# EAGLE design USB_Protect_A (EAGLE 6.5.0)
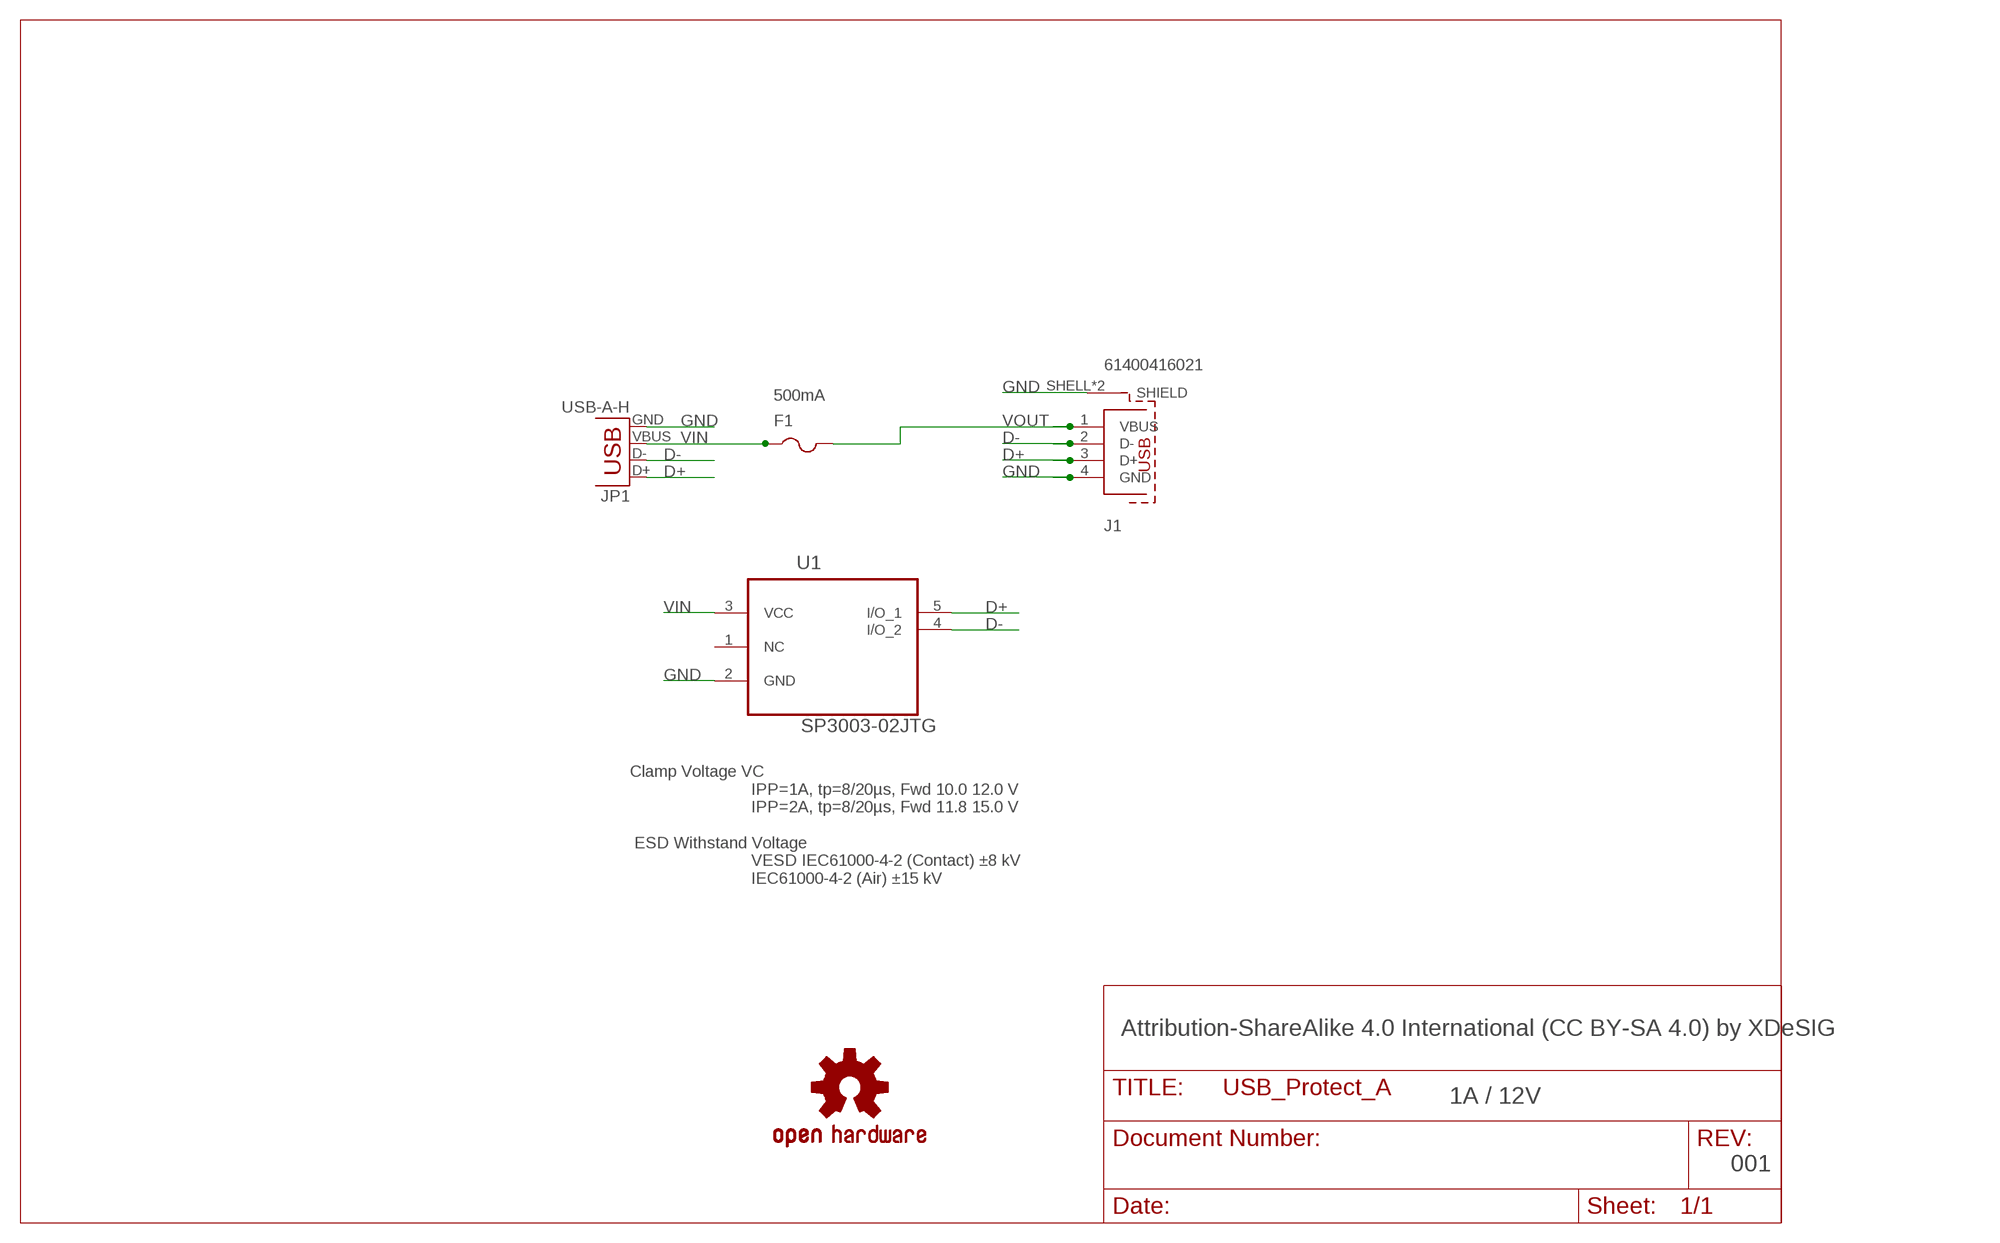
[diagram p0: schematic, sheet 1]

## Parts
F1  500mA  PTCFUSE-1206  [R1206]
J1  61400416021  [61400416021]
JP1  USB-A-H  [USB-A-H]
LOGO1  OSHW-LOGOS  [ESCORNA_LBRESCORNA_CPU_2_10_SPARKFUN-AESTHETICS_OSHW-LOGO-S]
U1  SP3003-02JTG  [SOT65P220X110-5N]

## Nets
D+: J1.3(D+) JP1.D+ U1.5(I/O_1)
D-: J1.2(D-) JP1.D- U1.4(I/O_2)
GND: J1.4(GND) J1.SHELL1(SHIELD) J1.SHELL(SHIELD) JP1.GND U1.2(GND)
VIN: F1.1 JP1.VBUS U1.3(VCC)
VOUT: F1.2 J1.1(VBUS)
Unconnected: U1.1(NC)

## Notes on the sheet
- Clamp Voltage VC 
                             IPP=1A, tp=8/20µs, Fwd 10.0 12.0 V 
                             IPP=2A, tp=8/20µs, Fwd 11.8 15.0 V
  
   ESD Withstand Voltage 
                             VESD IEC61000-4-2 (Contact) ±8 kV 
                             IEC61000-4-2 (Air) ±15 kV
- Attribution-ShareAlike 4.0 International (CC BY-SA 4.0) by XDeSIG
- 1A / 12V
- 001

## Library data of the parts
F1 = adafruit:PTCFUSE: PTC fuses, resettable thermistors
J1 = USB_female:61400416021: WR-COM Horizontal USB Type A=>Code :Con_I-O_COM_USB_2.0_A_61400416021 <http://katalog.we-online.de/media/images/eican/Con_I-O_COM_USB_2.0_A_61400416021_pf2.jpg> Details see: http://katalog.we-online.de/en/em/614_004_160_21 Created 2014-07-09, Karrer Zheng 2014 (C) Würth Elektronik; AVAILABILITY: Unavailable; DESCRIPTION: WR-COM Series, Right Angle Type A USB Connector Socket, 30 V ac, 1.5A; MF: Wurth Electronics; MP: 61400416021; PACKAGE: None; PRICE: None
JP1 = SparkFun-Connectors:USB: USB Connectors USB-B-PTH is fully proven SKU : PRT-00139/CONN-08278 USB-miniB is fully proven SKU : PRT-00587 USB-A-PCB is untested. USB-A-H is throughly reviewed, but untested. Spark Fun Electronics SKU : PRT-00437 USB-B-SMT is throughly reviewed, but untested. Needs silkscreen touching up. USB-A-S has not been used/tested USB-MB-H has not been used/tested USB-MICROB has been used. CONN-09505; PROD_ID: CONN-08367
LOGO1 = Echidna_shield_LBR:OSHW-LOGO: Open Source Hardware Logo This logo indicates the piece of hardware it is found on incorporates a OSHW license and/or adheres to the definition of open source hardware found here: http://freedomdefined.org/OSHW
U1 = SP3003-02JTG:SP3003-02JTG: 0.65pF Rail Clamp Array; AVAILABILITY: Good; DESCRIPTION: TVS DIODE 6VWM 15VC SC70-5; MF: Littelfuse; MP: SP3003-02JTG; PACKAGE: SC-70 Littelfuse; PRICE: 0.54 USD

## Net classes
0 default: width 0.254 mm, drill 0.61 mm, clearance 0.254 mm

## Board
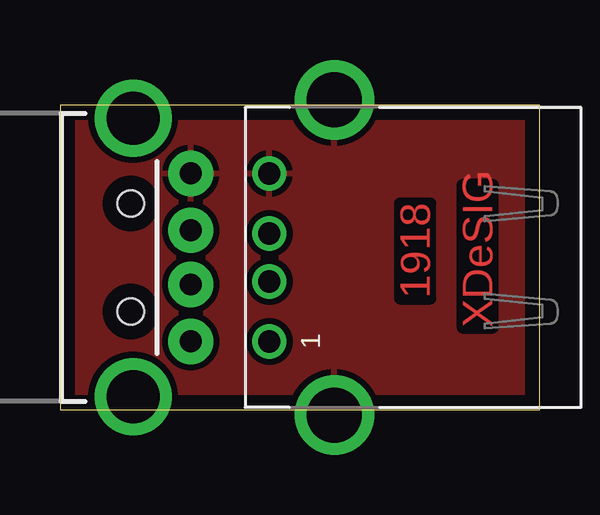
[diagram p1: board, top side]
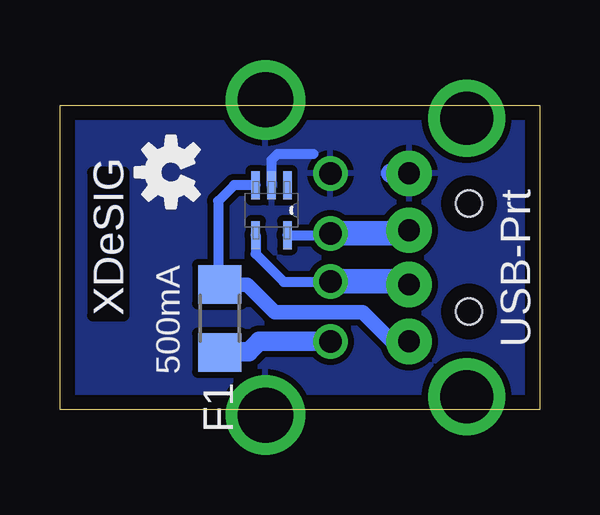
[diagram p2: board, bottom side, seen from below]

Size 19.99 x 12.69 mm. Coordinates in mm from the lower left corner, seen from the top.
Outline: 0,0 19.99,0 19.99,12.69 0,12.69 0,0
Copper layers (1*16): Top 0.035mm / dielectric 1.5mm / Bottom 0.035mm
Design rules "default": minimum track width 10mil, minimum drill 22mil, track to track 10mil, track to pad 10mil, pad to pad 8mil, via to via 12mil, smd to smd 8mil, copper to edge 24mil, drill to drill 12mil, minimum pad ring 10mil, minimum via ring 10mil, stop-mask expansion 2mil, vias tented up to drill 30mil, thermal gap 10mil

### Footprints (pad centres in the part's own frame; a part is rotated, then mirrored left to right if it is on the bottom)
R1206 = smd 1.6 x 1.803: 1 -1.422,0; 2 1.422,0
61400416021 = drill 0.92: 1 -3.5,2.71; 2 -1,2.71; 3 1,2.71; 4 3.5,2.71 | drill 2.3: SHELL -6.57,0; SHELL1 6.57,0
USB-A-H = drill 0.914 pad 1.88: D+ 2.4,1.127; D- 2.4,-1.127; GND 2.4,3.5; VBUS 2.4,-3.5 | drill 2.2: GND2 0,-5.8; GND3 0,5.8 | hole 1.1: -0.1,2.25; -0.1,-2.25
SOT65P220X110-5N = smd 1.168 x 0.356: 1 -1.041,0.66; 2 -1.041,0; 3 -1.041,-0.66; 4 1.041,-0.66; 5 1.041,0.66

### Placement (x,y rotation side)
F1  13.34,3.81 270 bottom
J1  11.43,6.35 90 top
JP1  3.05,6.35 0 top
LOGO1  15.37,9.91 90 bottom
U1  11.18,8.32 270 bottom

### Tracks (layer width: path | path; a pad name or v marks a point on that pad's centre or on a via)
D+
  Bottom 0.406: U1.5 8.79,7.28 J1.3
  Bottom 0.813: 6.34,7.35 JP1.D+
  Bottom 1.016: J1.3 6.21,7.35 JP1.D+
D-
  Bottom 0.406: U1.4 11.84,6.5 10.67,5.33 8.74,5.33 J1.2
  Bottom 1.016: J1.2 5.58,5.35 JP1.D-
GND
  Bottom 0.406: U1.2 11.18,10.41 10.92,10.67 9.42,10.67
  Bottom 0.813: 6.21,9.85 JP1.GND
  pour Bottom: 0,12.7 0,0 20.32,0 20.32,12.7
  pour Top: 0,13.97 0,0 21.59,0 21.59,13.97
VIN
  Bottom 0.406: U1.3 12.74,9.36 13.4,8.7 13.4,5.29 F1.1
  Bottom 0.61: JP1.VBUS 6.21,2.91 7.37,4.06 11.05,4.06 12.19,5.21 13.31,5.21 F1.1
VOUT
  Bottom 0.813: J1.1 11.69,2.85 12.13,2.41 13.31,2.41 F1.2

### Text on the board
Top: 1918 | XDeSIG
Bottom: XDeSIG
bPlace: 500mA | XDeSIG | USB-Prt